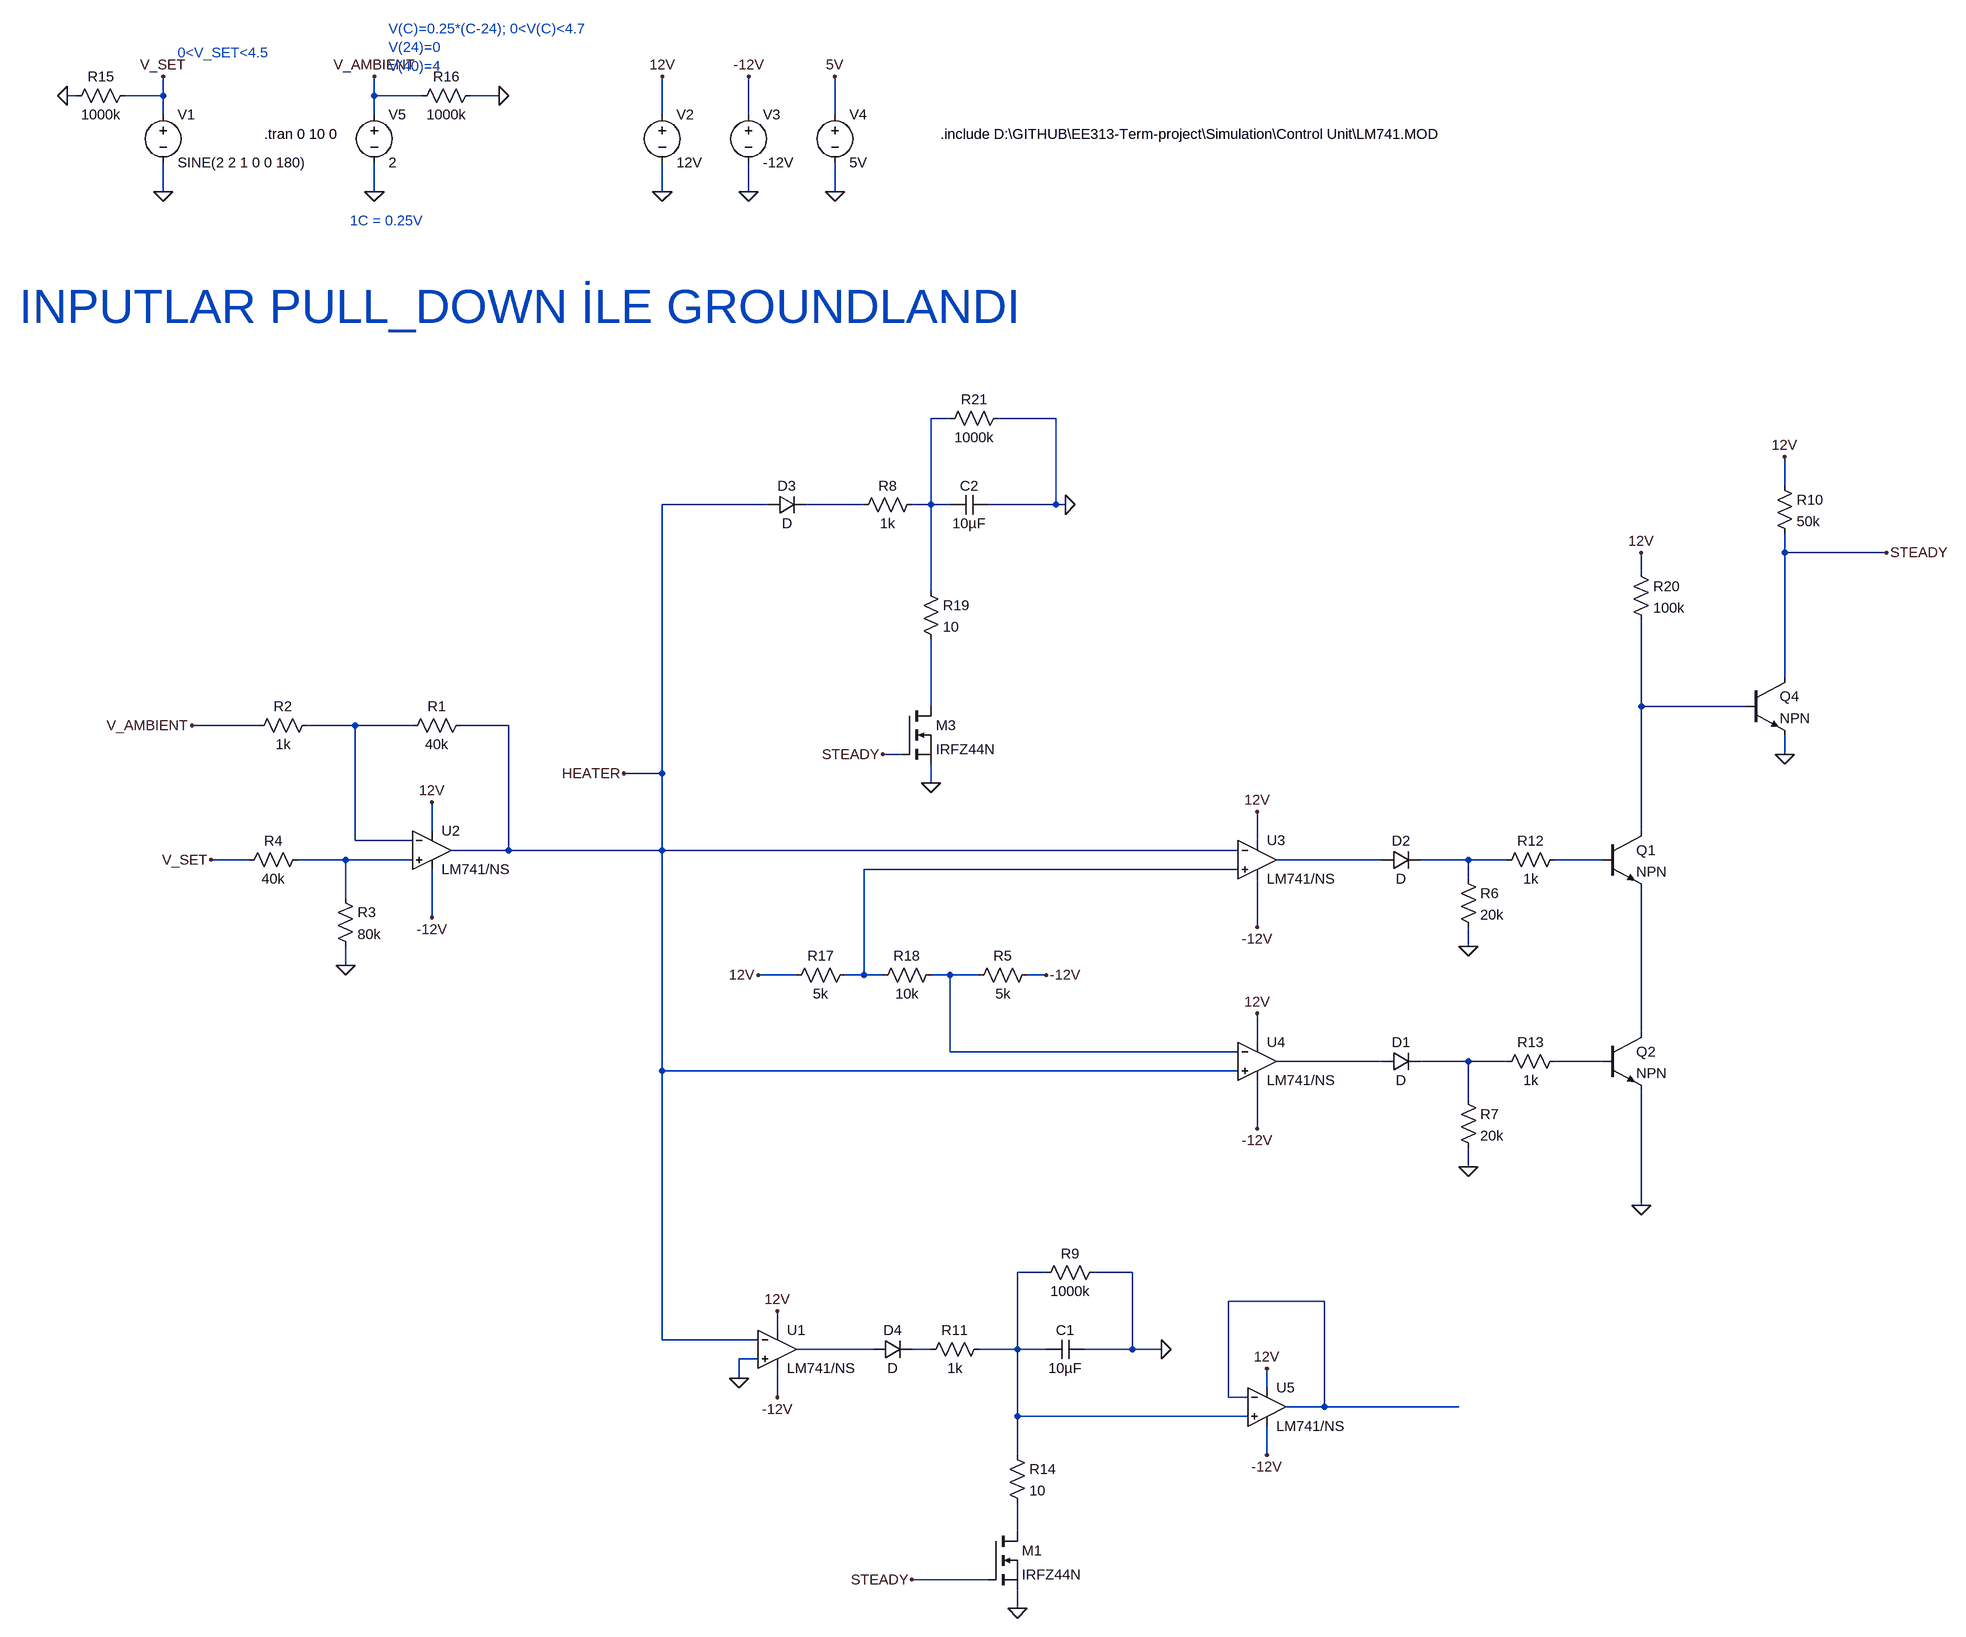
[diagram p0: schematic Control Unit.asc]
Control Unit.asc, the LTspice schematic file:
Version 4
SHEET 1 4272 2740
WIRE -1232 -512 -1248 -512
WIRE -1088 -512 -1088 -544
WIRE -1088 -512 -1152 -512
WIRE -736 -512 -736 -544
WIRE -656 -512 -736 -512
WIRE -528 -512 -576 -512
WIRE -1088 -480 -1088 -512
WIRE -736 -480 -736 -512
WIRE -256 -480 -256 -544
WIRE -112 -480 -112 -544
WIRE 32 -480 32 -544
WIRE -1088 -352 -1088 -400
WIRE -736 -352 -736 -400
WIRE -256 -352 -256 -400
WIRE -112 -352 -112 -400
WIRE 32 -352 32 -400
WIRE 224 656 192 656
WIRE 400 656 304 656
WIRE 1712 768 1712 720
WIRE -80 800 -256 800
WIRE 80 800 -16 800
WIRE 192 800 192 656
WIRE 192 800 160 800
WIRE 224 800 192 800
WIRE 400 800 400 656
WIRE 400 800 288 800
WIRE 416 800 400 800
WIRE 1712 880 1712 848
WIRE 1920 880 1712 880
WIRE 1376 912 1376 880
WIRE 192 944 192 800
WIRE 1712 1088 1712 880
WIRE 192 1136 192 1024
WIRE 1376 1136 1376 992
WIRE 1648 1136 1376 1136
WIRE -928 1168 -1040 1168
WIRE -768 1168 -848 1168
WIRE -672 1168 -768 1168
WIRE -512 1168 -592 1168
WIRE 144 1216 112 1216
WIRE 1712 1216 1712 1184
WIRE -256 1248 -256 800
WIRE -256 1248 -320 1248
WIRE 192 1264 192 1232
WIRE -640 1344 -640 1296
WIRE 1376 1344 1376 1136
WIRE -768 1360 -768 1168
WIRE -672 1360 -768 1360
WIRE 736 1360 736 1312
WIRE -512 1376 -512 1168
WIRE -512 1376 -608 1376
WIRE -256 1376 -256 1248
WIRE -256 1376 -512 1376
WIRE 704 1376 -256 1376
WIRE -944 1392 -1008 1392
WIRE -784 1392 -864 1392
WIRE -672 1392 -784 1392
WIRE 944 1392 768 1392
WIRE 1088 1392 1008 1392
WIRE 1152 1392 1088 1392
WIRE 1312 1392 1232 1392
WIRE 704 1408 80 1408
WIRE 1088 1424 1088 1392
WIRE -784 1456 -784 1392
WIRE -640 1488 -640 1408
WIRE 736 1504 736 1424
WIRE 1088 1536 1088 1504
WIRE -784 1568 -784 1536
WIRE -32 1584 -96 1584
WIRE 80 1584 80 1408
WIRE 80 1584 48 1584
WIRE 112 1584 80 1584
WIRE 224 1584 192 1584
WIRE 272 1584 224 1584
WIRE 384 1584 352 1584
WIRE 1376 1680 1376 1440
WIRE 736 1696 736 1648
WIRE 224 1712 224 1584
WIRE 704 1712 224 1712
WIRE 944 1728 768 1728
WIRE 1088 1728 1008 1728
WIRE 1152 1728 1088 1728
WIRE 1312 1728 1232 1728
WIRE -256 1744 -256 1376
WIRE 704 1744 -256 1744
WIRE 1088 1792 1088 1728
WIRE 736 1840 736 1760
WIRE 1088 1904 1088 1872
WIRE 1376 1968 1376 1776
WIRE 384 2080 336 2080
WIRE 528 2080 464 2080
WIRE 848 2128 688 2128
WIRE -64 2176 -64 2144
WIRE -256 2192 -256 1744
WIRE -96 2192 -256 2192
WIRE 96 2208 -32 2208
WIRE 192 2208 160 2208
WIRE 336 2208 336 2080
WIRE 336 2208 272 2208
WIRE 384 2208 336 2208
WIRE 528 2208 528 2080
WIRE 528 2208 448 2208
WIRE 576 2208 528 2208
WIRE -96 2224 -128 2224
WIRE -128 2256 -128 2224
WIRE 752 2272 752 2240
WIRE -64 2288 -64 2240
WIRE 688 2288 688 2128
WIRE 720 2288 688 2288
WIRE 848 2304 848 2128
WIRE 848 2304 784 2304
WIRE 1072 2304 848 2304
WIRE 336 2320 336 2208
WIRE 720 2320 336 2320
WIRE 336 2384 336 2320
WIRE 752 2384 752 2336
WIRE 336 2512 336 2464
WIRE 288 2592 160 2592
WIRE 336 2640 336 2608
FLAG -1088 -352 0
FLAG -1088 -544 V_SET
FLAG -256 -352 0
FLAG -256 -544 12V
FLAG -112 -352 0
FLAG -112 -544 -12V
FLAG 32 -352 0
FLAG 32 -544 5V
FLAG -736 -352 0
FLAG -736 -544 V_AMBIENT
FLAG -640 1296 12V
FLAG -640 1488 -12V
FLAG -784 1568 0
FLAG -1008 1392 V_SET
FLAG -1040 1168 V_AMBIENT
FLAG 736 1312 12V
FLAG 736 1504 -12V
FLAG 736 1648 12V
FLAG 736 1840 -12V
FLAG 1376 880 12V
FLAG -528 -512 0
FLAG -1248 -512 0
FLAG -96 1584 12V
FLAG 384 1584 -12V
FLAG 1088 1536 0
FLAG 1088 1904 0
FLAG 1376 1968 0
FLAG -320 1248 HEATER
FLAG -64 2144 12V
FLAG -64 2288 -12V
FLAG 1712 1216 0
FLAG 1712 720 12V
FLAG 1920 880 STEADY
FLAG 192 1264 0
FLAG 112 1216 STEADY
FLAG 416 800 0
FLAG 336 2640 0
FLAG 160 2592 STEADY
FLAG 576 2208 0
FLAG -128 2256 0
FLAG 752 2240 12V
FLAG 752 2384 -12V
SYMBOL voltage -1088 -496 R0
WINDOW 123 0 0 Left 0
WINDOW 39 0 0 Left 0
SYMATTR InstName V1
SYMATTR Value SINE(2 2 1 0 0 180)
SYMBOL voltage -256 -496 R0
WINDOW 123 0 0 Left 0
WINDOW 39 0 0 Left 0
SYMATTR InstName V2
SYMATTR Value 12V
SYMBOL voltage -112 -496 R0
WINDOW 123 0 0 Left 0
WINDOW 39 0 0 Left 0
SYMATTR InstName V3
SYMATTR Value -12V
SYMBOL voltage 32 -496 R0
WINDOW 123 0 0 Left 0
WINDOW 39 0 0 Left 0
SYMATTR InstName V4
SYMATTR Value 5V
SYMBOL voltage -736 -496 R0
WINDOW 123 0 0 Left 0
WINDOW 39 0 0 Left 0
SYMATTR InstName V5
SYMATTR Value 2
SYMBOL OpAmps\\opamp2 -640 1312 R0
SYMATTR InstName U2
SYMATTR Value LM741/NS
SYMBOL res -576 1152 R90
WINDOW 0 0 56 VBottom 2
WINDOW 3 32 56 VTop 2
SYMATTR InstName R1
SYMATTR Value 40k
SYMBOL res -832 1152 R90
WINDOW 0 0 56 VBottom 2
WINDOW 3 32 56 VTop 2
SYMATTR InstName R2
SYMATTR Value 1k
SYMBOL res -800 1440 R0
SYMATTR InstName R3
SYMATTR Value 80k
SYMBOL res -848 1376 R90
WINDOW 0 0 56 VBottom 2
WINDOW 3 32 56 VTop 2
SYMATTR InstName R4
SYMATTR Value 40k
SYMBOL OpAmps\\opamp2 736 1328 R0
SYMATTR InstName U3
SYMATTR Value LM741/NS
SYMBOL OpAmps\\opamp2 736 1664 R0
SYMATTR InstName U4
SYMATTR Value LM741/NS
SYMBOL npn 1312 1344 R0
SYMATTR InstName Q1
SYMBOL npn 1312 1680 R0
SYMATTR InstName Q2
SYMBOL res 1248 1376 R90
WINDOW 0 0 56 VBottom 2
WINDOW 3 32 56 VTop 2
SYMATTR InstName R12
SYMATTR Value 1k
SYMBOL res 1248 1712 R90
WINDOW 0 0 56 VBottom 2
WINDOW 3 32 56 VTop 2
SYMATTR InstName R13
SYMATTR Value 1k
SYMBOL res -1136 -528 R90
WINDOW 0 0 56 VBottom 2
WINDOW 3 32 56 VTop 2
SYMATTR InstName R15
SYMATTR Value 1000k
SYMBOL res -560 -528 R90
WINDOW 0 0 56 VBottom 2
WINDOW 3 32 56 VTop 2
SYMATTR InstName R16
SYMATTR Value 1000k
SYMBOL res 64 1568 R90
WINDOW 0 0 56 VBottom 2
WINDOW 3 32 56 VTop 2
SYMATTR InstName R17
SYMATTR Value 5k
SYMBOL res 208 1568 R90
WINDOW 0 0 56 VBottom 2
WINDOW 3 32 56 VTop 2
SYMATTR InstName R18
SYMATTR Value 10k
SYMBOL res 1360 896 R0
SYMATTR InstName R20
SYMATTR Value 100k
SYMBOL res 368 1568 R90
WINDOW 0 0 56 VBottom 2
WINDOW 3 32 56 VTop 2
SYMATTR InstName R5
SYMATTR Value 5k
SYMBOL diode 944 1744 R270
WINDOW 0 32 32 VTop 2
WINDOW 3 0 32 VBottom 2
SYMATTR InstName D1
SYMBOL diode 944 1408 R270
WINDOW 0 32 32 VTop 2
WINDOW 3 0 32 VBottom 2
SYMATTR InstName D2
SYMBOL res 1072 1408 R0
SYMATTR InstName R6
SYMATTR Value 20k
SYMBOL res 1072 1776 R0
SYMATTR InstName R7
SYMATTR Value 20k
SYMBOL diode -80 816 R270
WINDOW 0 32 32 VTop 2
WINDOW 3 0 32 VBottom 2
SYMATTR InstName D3
SYMBOL OpAmps\\opamp2 -64 2144 R0
SYMATTR InstName U1
SYMATTR Value LM741/NS
SYMBOL res 176 784 R90
WINDOW 0 0 56 VBottom 2
WINDOW 3 32 56 VTop 2
SYMATTR InstName R8
SYMATTR Value 1k
SYMBOL npn 1648 1088 R0
SYMATTR InstName Q4
SYMBOL res 1696 752 R0
SYMATTR InstName R10
SYMATTR Value 50k
SYMBOL cap 288 784 R90
WINDOW 0 0 32 VBottom 2
WINDOW 3 32 32 VTop 2
SYMATTR InstName C2
SYMATTR Value 10µF
SYMBOL cap 448 2192 R90
WINDOW 0 0 32 VBottom 2
WINDOW 3 32 32 VTop 2
SYMATTR InstName C1
SYMATTR Value 10µF
SYMBOL nmos 144 1136 R0
SYMATTR InstName M3
SYMATTR Value IRFZ44N
SYMBOL res 288 2192 R90
WINDOW 0 0 56 VBottom 2
WINDOW 3 32 56 VTop 2
SYMATTR InstName R11
SYMATTR Value 1k
SYMBOL res 320 2368 R0
SYMATTR InstName R14
SYMATTR Value 10
SYMBOL diode 96 2224 R270
WINDOW 0 32 32 VTop 2
WINDOW 3 0 32 VBottom 2
SYMATTR InstName D4
SYMBOL res 176 928 R0
SYMATTR InstName R19
SYMATTR Value 10
SYMBOL nmos 288 2512 R0
SYMATTR InstName M1
SYMATTR Value IRFZ44N
SYMBOL res 480 2064 R90
WINDOW 0 0 56 VBottom 2
WINDOW 3 32 56 VTop 2
SYMATTR InstName R9
SYMATTR Value 1000k
SYMBOL res 320 640 R90
WINDOW 0 0 56 VBottom 2
WINDOW 3 32 56 VTop 2
SYMATTR InstName R21
SYMATTR Value 1000k
SYMBOL OpAmps\\opamp2 752 2240 R0
SYMATTR InstName U5
SYMATTR Value LM741/NS
TEXT 208 -448 Left 2 !.include D:\\GITHUB\\EE313-Term-project\\Simulation\\Control Unit\\LM741.MOD
TEXT -920 -448 Left 2 !.tran 0 10 0
TEXT -712 -624 Left 2 ;V(C)=0.25*(C-24); 0<V(C)<4.7\nV(24)=0\nV(40)=4
TEXT -1064 -584 Left 2 ;0<V_SET<4.5
TEXT -776 -304 Left 2 ;1C = 0.25V
TEXT -1328 -160 Left 6 ;INPUTLAR PULL_DOWN İLE GROUNDLANDI

The netlist it stands for:
* Control Unit.asc
V1 V_SET 0 SINE(2 2 1 0 0 180)
V2 12V 0 12V
V3 -12V 0 -12V
V4 5V 0 5V
V5 V_AMBIENT 0 2
XU2 N006 N005 12V -12V HEATER LM741/NS  ; pins In+ In- V+ V- OUT
R1 HEATER N005 40k
R2 N005 V_AMBIENT 1k
R3 N006 0 80k
R4 N006 V_SET 40k
XU3 N010 HEATER 12V -12V N007 LM741/NS  ; pins In+ In- V+ V- OUT
XU4 HEATER N011 12V -12V N013 LM741/NS  ; pins In+ In- V+ V- OUT
Q1 N004 N009 N012 0 NPN
Q2 N012 N015 0 0 NPN
R12 N009 N008 1k
R13 N015 N014 1k
R15 V_SET 0 1000k
R16 0 V_AMBIENT 1000k
R17 N010 12V 5k
R18 N011 N010 10k
R20 12V N004 100k
R5 -12V N011 5k
D1 N013 N014 D
D2 N007 N008 D
R6 N008 0 20k
R7 N014 0 20k
D3 HEATER N002 D
XU1 0 HEATER 12V -12V N018 LM741/NS  ; pins In+ In- V+ V- OUT
R8 N001 N002 1k
Q4 STEADY N004 0 0 NPN
R10 12V STEADY 50k
C2 0 N001 10µF
C1 0 N016 10µF
M3 N003 STEADY 0 0 IRFZ44N
R11 N016 N019 1k
R14 N016 N020 10
D4 N018 N019 D
R19 N001 N003 10
M1 N020 STEADY 0 0 IRFZ44N
R9 0 N016 1000k
R21 0 N001 1000k
XU5 N016 N017 12V -12V N017 LM741/NS  ; pins In+ In- V+ V- OUT
.model D D
.lib standard.dio
.model NPN NPN
.model PNP PNP
.lib standard.bjt
.model NMOS NMOS
.model PMOS PMOS
.lib standard.mos
.include D:\GITHUB\EE313-Term-project\Simulation\Control Unit\LM741.MOD
.tran 0 10 0
* V(C)=0.25*(C-24); 0<V(C)<4.7
* V(24)=0
* V(40)=4
* 0<V_SET<4.5
* 1C = 0.25V
* INPUTLAR PULL_DOWN İLE GROUNDLANDI
.backanno
.end